# EAGLE design music-thing (EAGLE 7.7.0)
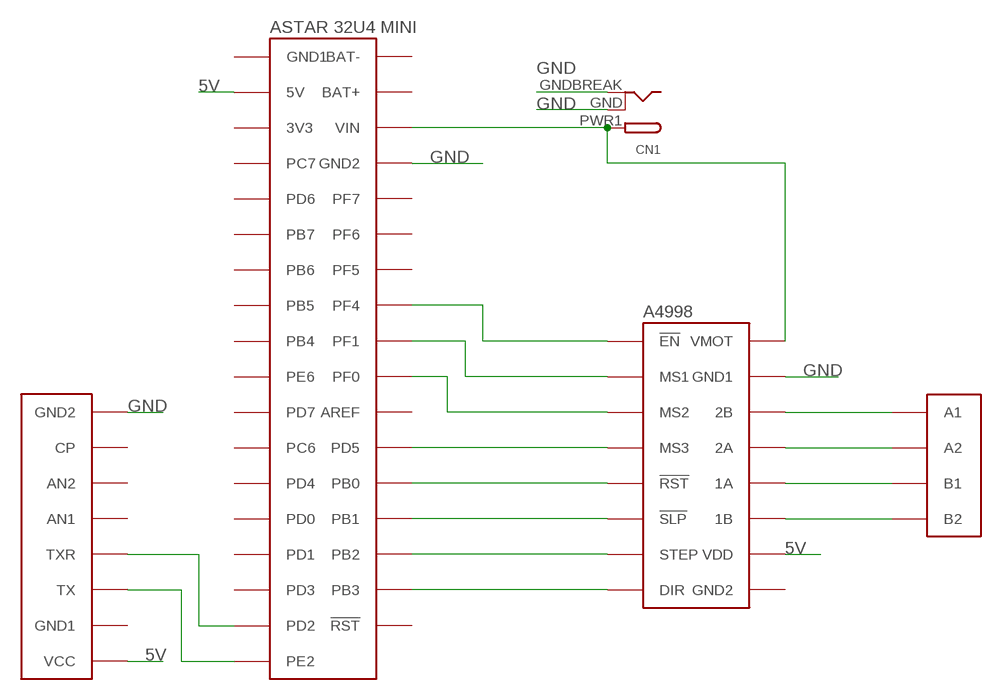
[diagram p0: schematic, sheet 1]

## Parts
CN1  DCBARRELSMT  [DCJACK_2MM_SMT]
U$1  A4998  [A4998]
U$2  ASTAR32U4MINI  [ASTAR32U4MINI]
U$3  CON-USB-READER-V18  [CON-USB-READER-V18]
U$4  CON-MOTOR  [CON-MOTOR]

## Nets
5V: U$1.VDD U$2.5V U$3.VCC
GND: CN1.GND(GNDBREAK) CN1.GNDBREAK(GND) U$1.GND1 U$2.GND2 U$3.GND2
N$1: U$1.2B U$4.A1
N$2: U$1.2A U$4.A2
N$3: U$1.1A U$4.B1
N$4: U$1.1B U$4.B2
N$6: U$1.DIR U$2.PB3
N$7: U$1.STP(STEP) U$2.PB2
N$8: U$1.!SLP U$2.PB1
N$9: U$1.!RST U$2.PB0
N$10: U$1.MS3 U$2.PD5
N$11: U$1.MS2 U$2.PF0
N$12: U$1.MS1 U$2.PF1
N$13: U$1.!EN U$2.PF4
N$14: U$2.PE2 U$3.TX
N$15: U$2.PD2 U$3.TXR
N$16: CN1.PWR1(PWR) U$1.VMOT U$2.VIN
Unconnected: U$1.GND2 U$2.3V3 U$2.!RST U$2.AREF U$2.BAT+ U$2.BAT- U$2.GND1 U$2.PB4 U$2.PB5 U$2.PB6 U$2.PB7 U$2.PC6 U$2.PC7 U$2.PD0 U$2.PD1 U$2.PD3 U$2.PD4 U$2.PD6 U$2.PD7 U$2.PE6 U$2.PF5 U$2.PF6 U$2.PF7 U$3.AN1 U$3.AN2 U$3.CP U$3.GND1

## Library data of the parts
CN1 = adafruit:DCBARREL: 2.0mm DC Barrel Jack DCJACK_2MM_PTH - Through Hole Jack (4UConnector: 05537)
U$1 = weller-eagle:A4998
U$2 = weller-eagle:ASTAR32U4MINI
U$3 = weller-eagle:CON-USB-READER-V18
U$4 = weller-eagle:CON-MOTOR

## Board
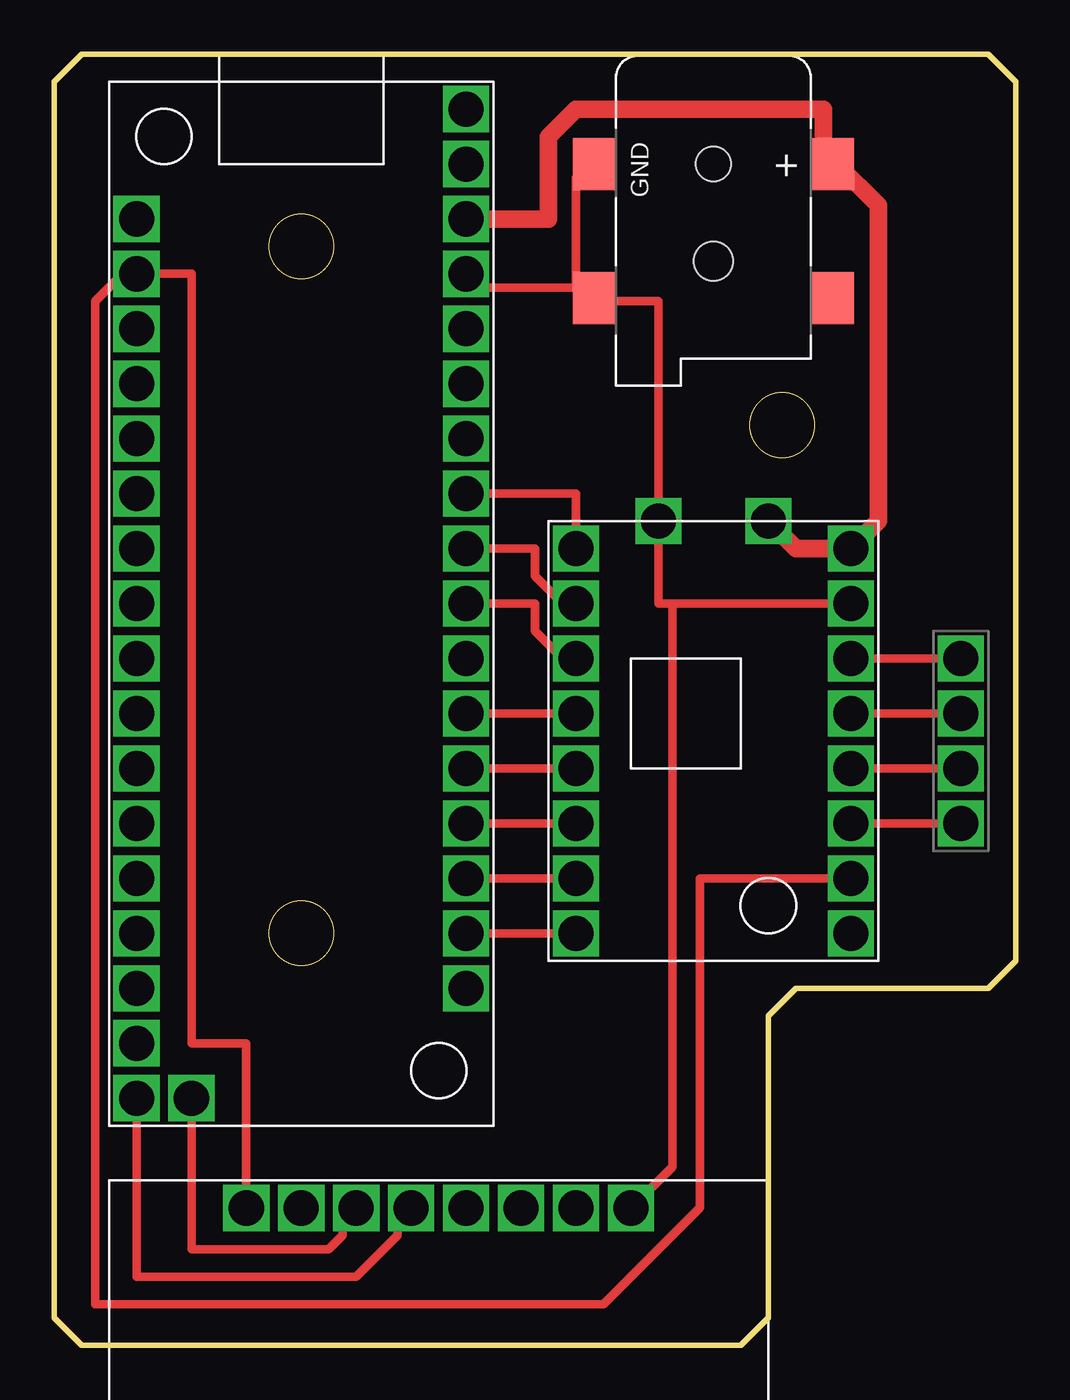
[diagram p1: board, top side]

Size 44.45 x 59.69 mm. Coordinates in mm from the lower left corner, seen from the top.
Outline: 0,58.42 0,1.27 1.27,0 31.75,0 33.02,1.27 33.02,15.24 34.29,16.51 43.18,16.51 44.45,17.78 44.45,58.42 43.18,59.69 1.27,59.69 0,58.42
Outline: circle at 11.43,50.8 radius 1.5
Outline: circle at 11.43,19.05 radius 1.5
Outline: circle at 33.66,42.55 radius 1.5
Copper layers (1*16): Top 0.035mm / dielectric 1.5mm / Bottom 0.035mm
Design rules "fab *": minimum track width 0.4mm, minimum drill 32mil, track to track 0.397mm, track to pad 0.397mm, pad to pad 0.397mm, via to via 0.397mm, smd to smd 0.315mm, copper to edge 40mil, drill to drill 16mil, minimum pad ring 10mil, minimum via ring 8mil, stop-mask expansion 4mil, vias tented up to drill 0mil, thermal gap 10mil

### Footprints (pad centres in the part's own frame; a part is rotated, then mirrored left to right if it is on the bottom)
DCJACK_2MM_SMT = smd 2.4 x 2: GND 0,-5.5; GNDBREAK 6.2,-5.5; PWR1 0,5.5; PWR2 6.2,5.5 | hole 1.6: 0,0 | hole 1.8: 4.5,0
A4998 = drill 1.62 pad 2.134 square: 1A 13.97,8.89; 1B 13.97,6.35; 2A 13.97,11.43; 2B 13.97,13.97; !EN 1.27,19.05; !RST 1.27,8.89; !SLP 1.27,6.35; DIR 1.27,1.27; GND1 13.97,16.51; GND2 13.97,1.27; MS1 1.27,16.51; MS2 1.27,13.97; MS3 1.27,11.43; STP 1.27,3.81; VDD 13.97,3.81; VMOT 13.97,19.05
ASTAR32U4MINI = drill 1.62 pad 2.134 square: 3V3 1.27,36.83; 5V 1.27,39.37; !RST 16.51,6.35; AREF 16.51,21.59; BAT+ 16.51,44.45; BAT- 16.51,46.99; GND1 1.27,41.91; GND2 16.51,39.37; PB0 16.51,16.51; PB1 16.51,13.97; PB2 16.51,11.43; PB3 16.51,8.89; PB4 1.27,21.59; PB5 1.27,24.13; PB6 1.27,26.67; PB7 1.27,29.21; PC6 1.27,13.97; PC7 1.27,34.29; PD0 1.27,8.89; PD1 1.27,6.35; PD2 1.27,1.27; PD3 1.27,3.81; PD4 1.27,11.43; PD5 16.51,19.05; PD6 1.27,31.75; PD7 1.27,16.51; PE2 3.81,1.27; PE6 1.27,19.05; PF0 16.51,24.13; PF1 16.51,26.67; PF4 16.51,29.21; PF5 16.51,31.75; PF6 16.51,34.29; PF7 16.51,36.83; VIN 16.51,41.91
CON-USB-READER-V18 = drill 1.62 pad 2.134 square: AN1 38.1,13.97; AN2 38.1,11.43; CP 38.1,8.89; GND1 38.1,21.59; GND2 38.1,6.35; TX 38.1,19.05; TXR 38.1,16.51; VCC 38.1,24.13
CON-MOTOR = drill 1.62 pad 2.134 square: A1 2.54,7.62; A2 2.54,5.08; B1 2.54,2.54; B2 2.54,0

### Placement (x,y rotation side)
CN1  30.48,54.61 270 top
U$1  22.86,17.78 0 top
U$2  2.54,10.16 0 top
U$3  33.02,-31.75 90 top
U$4  39.37,24.13 0 top

### Tracks (layer width: path | path; a pad name or v marks a point on that pad's centre or on a via)
5V
  Top 0.4: U$3.VCC 8.89,13.97 6.35,13.97 6.35,49.53 U$2.5V 3.17,49.53 1.91,48.26 1.91,1.91 25.4,1.91 29.84,6.35 29.84,21.59 U$1.VDD
GND  (via drill 1.62 pad 2.13)
  Top 0.4: 24.13,48.9 19.05,48.9 U$2.GND2 | 24.13,48.9 24.77,48.9 CN1.GNDBREAK | 24.13,48.9 24.13,53.98 24.77,54.61 CN1.GND | 24.13,48.9 CN1.GNDBREAK | U$3.GND2 28.57,8.25 28.57,34.29 | U$1.GND1 28.57,34.29 | 28.57,34.29 27.94,34.29 v27.94,38.1 27.94,48.26 25.4,48.26 CN1.GNDBREAK
N$1
  Top 0.4: U$4.A1 U$1.2B
N$2
  Top 0.4: U$4.A2 U$1.2A
N$3
  Top 0.4: U$4.B1 U$1.1A
N$4
  Top 0.4: U$4.B2 U$1.1B
N$6
  Top 0.4: U$1.DIR U$2.PB3
N$7
  Top 0.4: U$1.STP U$2.PB2
N$8
  Top 0.4: U$1.!SLP U$2.PB1
N$9
  Top 0.4: U$1.!RST U$2.PB0
N$10
  Top 0.4: U$1.MS3 U$2.PD5
N$11
  Top 0.4: U$2.PF0 22.23,34.29 22.23,33.02 23.5,31.75 U$1.MS2
N$12
  Top 0.4: U$2.PF1 22.23,36.83 22.23,35.56 23.5,34.29 U$1.MS1
N$13
  Top 0.4: U$2.PF4 24.13,39.37 U$1.!EN
N$14
  Top 0.4: U$3.TX 13.34,5.71 13.34,5.08 12.7,4.45 6.35,4.45 U$2.PE2
N$15
  Top 0.4: U$3.TXR 15.88,5.71 15.88,5.08 13.97,3.18 3.81,3.18 U$2.PD2
N$16  (via drill 1.62 pad 2.13)
  Top 0.4: 36.2,54.61 CN1.PWR1 35.56,54.61
  Top 0.8: 36.2,54.61 38.1,52.71 38.1,38.1 U$1.VMOT 34.29,36.83 v33.02,38.1 | U$2.VIN 22.86,52.07 22.86,55.88 24.13,57.15 35.56,57.15 35.56,54.61